# Altium schematic sheet Aux_Outputs.SchDoc: RP2040 CNC
size B; Author: AM; CompanyName: Expatria Technologies; DrawnBy: A.Marles; Engineer: AM; Organization: Expatria Technolgoies; Address1: PO Box 2084; Address3: Merritt, BC V1K 1B8; Address4: Canada; DocumentNumber: 13; SheetNumber: 10; SheetTotal: 26
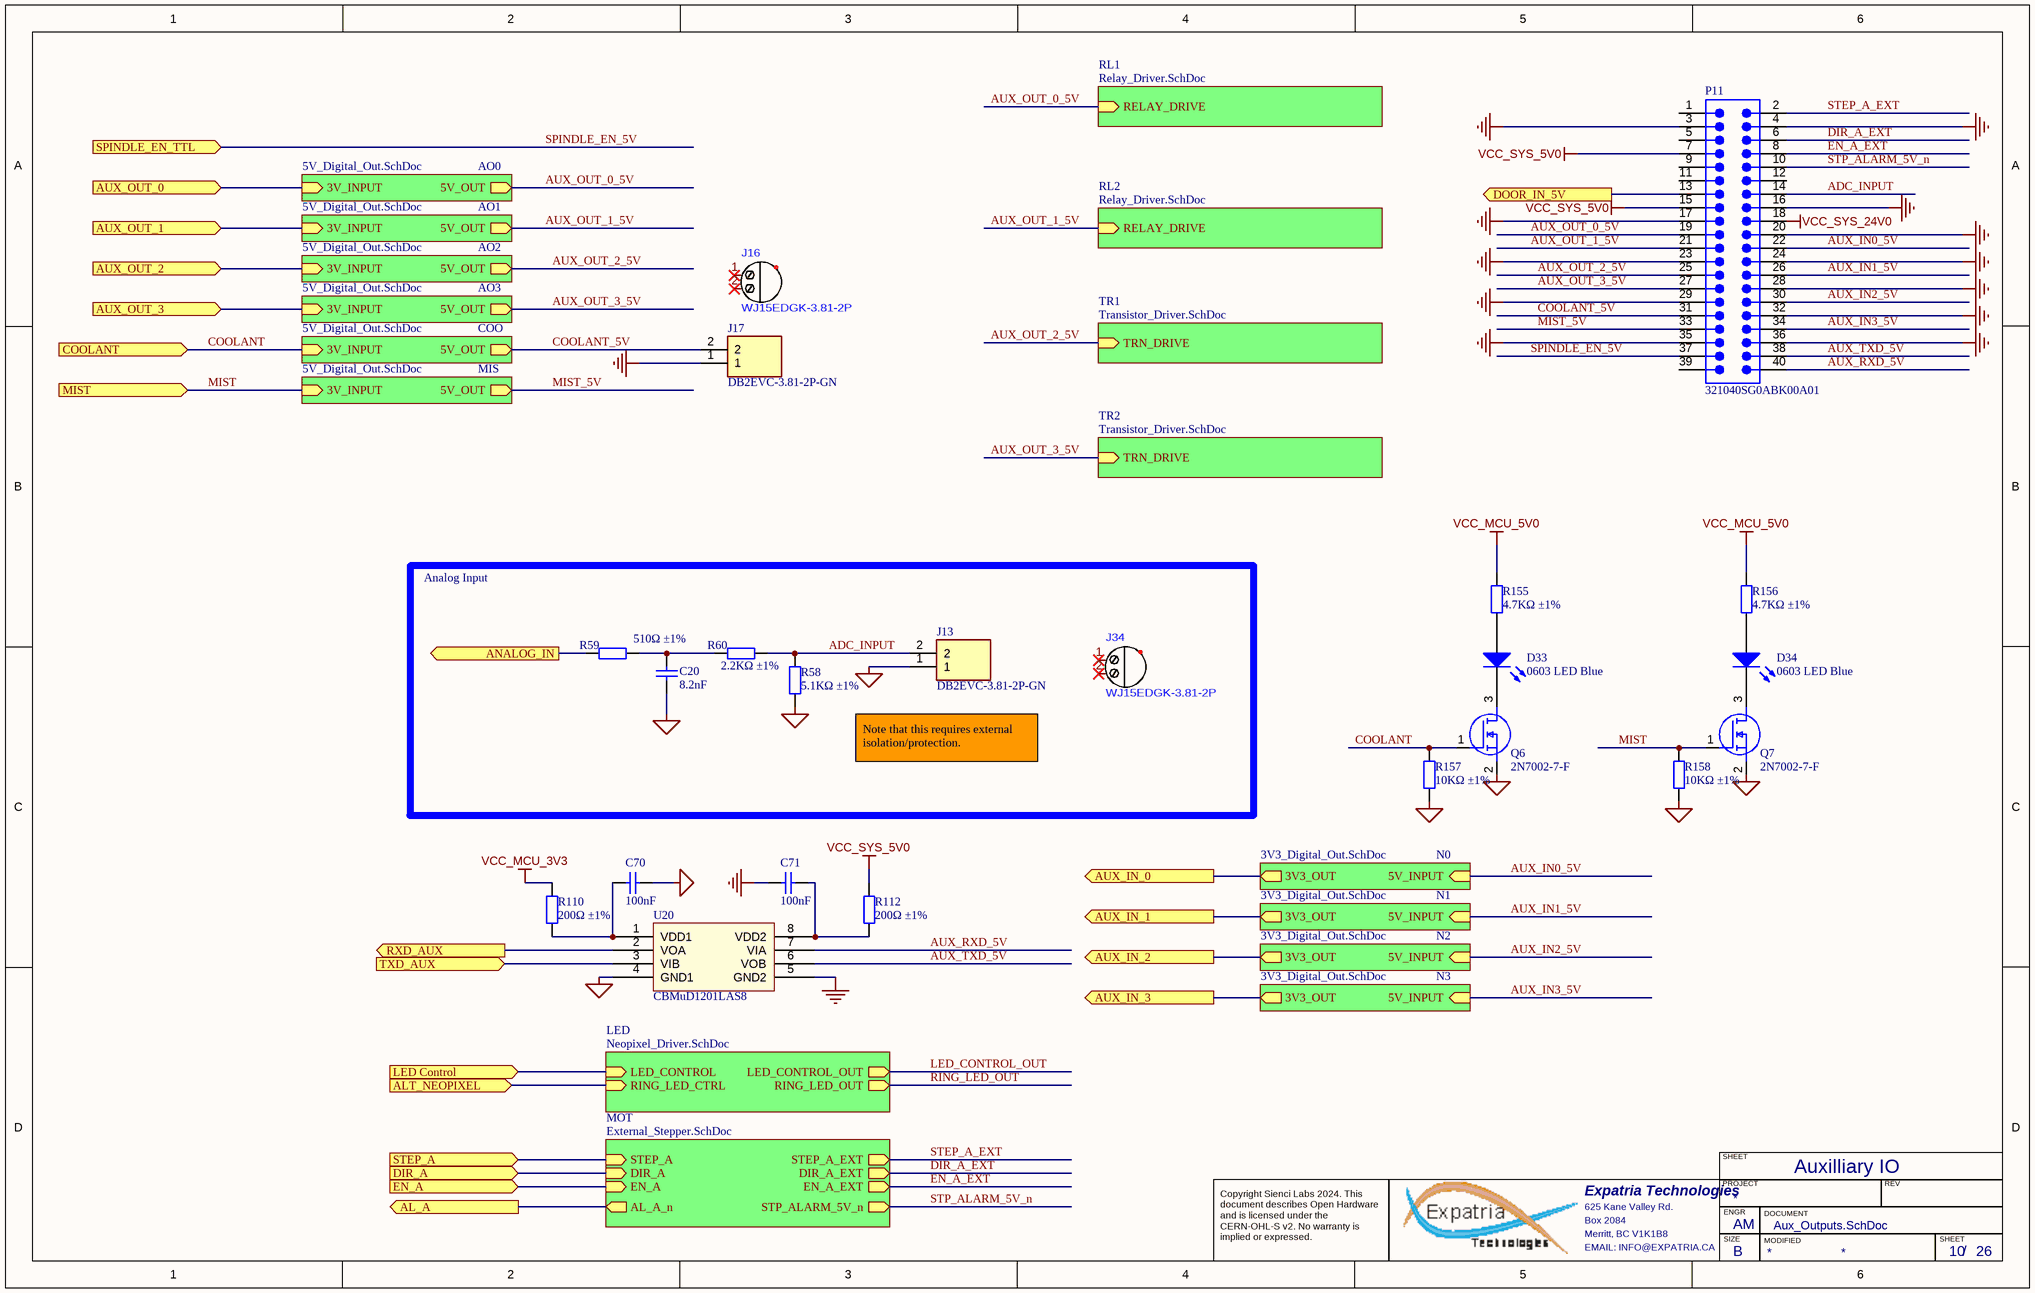
[diagram p0: Aux_Outputs.SchDoc]

## Parts
C20  8.2nF  [0603_C]
C70  100nF  [0402_C]
C71  100nF  [0402_C]
D33  0603 LED Blue  [0603_LED_S1 - BLUE]
D34  0603 LED Blue  [0603_LED_S1 - BLUE]
J13  DB2EVC-3.81-2P-GN  [CONN-TH_5P-P3.81_DB2EVC-3.81-2p]
J16  WJ15EDGK-3.81-2P  (mechanical)
J17  DB2EVC-3.81-2P-GN  [CONN-TH_5P-P3.81_DB2EVC-3.81-2p]
J34  WJ15EDGK-3.81-2P  (mechanical)
P11  321040SG0ABK00A01  [IDC-TH_40P-P2.54_321040SG0ABK00A01]
Q6  2N7002-7-F  [SOT-23(SOT-23-3)]
Q7  2N7002-7-F  [SOT-23(SOT-23-3)]
R58  5.1KΩ ±1%  [0402_R]
R59  510Ω ±1%  [0402_R]
R60  2.2KΩ ±1%  [0402_R]
R110  200Ω ±1%  [0402_R]
R112  200Ω ±1%  [0402_R]
R155  4.7KΩ ±1%  [0402_R]
R156  4.7KΩ ±1%  [0402_R]
R157  10KΩ ±1%  [0603_R]
R158  10KΩ ±1%  [0603_R]
U20  CBMuD1201LAS8  [SOIC-8_150mil]

## Blocks framed on the sheet
Analog Input: C20 J13 J34 R58-R60

## Sub-sheets
AO0 = 5V_Digital_Out.SchDoc: 5V_OUT (out), 3V_INPUT (in)
AO1 = 5V_Digital_Out.SchDoc: 5V_OUT (out), 3V_INPUT (in)
AO2 = 5V_Digital_Out.SchDoc: 5V_OUT (out), 3V_INPUT (in)
AO3 = 5V_Digital_Out.SchDoc: 5V_OUT (out), 3V_INPUT (in)
COO = 5V_Digital_Out.SchDoc: 5V_OUT (out), 3V_INPUT (in)
LED = Neopixel_Driver.SchDoc: LED_CONTROL (in), LED_CONTROL_OUT (out), RING_LED_OUT (out), RING_LED_CTRL (in)
MIS = 5V_Digital_Out.SchDoc: 5V_OUT (out), 3V_INPUT (in)
MOT = External_Stepper.SchDoc: STEP_A (in), EN_A (in), AL_A_n (out), DIR_A (in), EN_A_EXT (out), DIR_A_EXT (out), STP_ALARM_5V_n (out), STEP_A_EXT (out)
N0 = 3V3_Digital_Out.SchDoc: 3V3_OUT (out), 5V_INPUT (in)
N1 = 3V3_Digital_Out.SchDoc: 3V3_OUT (out), 5V_INPUT (in)
N2 = 3V3_Digital_Out.SchDoc: 3V3_OUT (out), 5V_INPUT (in)
N3 = 3V3_Digital_Out.SchDoc: 3V3_OUT (out), 5V_INPUT (in)
RL1 = Relay_Driver.SchDoc: RELAY_DRIVE (in)
RL2 = Relay_Driver.SchDoc: RELAY_DRIVE (in)
TR1 = Transistor_Driver.SchDoc: TRN_DRIVE (in)
TR2 = Transistor_Driver.SchDoc: TRN_DRIVE (in)

## Ports
AL_A (out), ALT_NEOPIXEL (in), ANALOG_IN (out), AUX_IN_0 (out), AUX_IN_1 (out), AUX_IN_2 (out), AUX_IN_3 (out), AUX_OUT_0 (in), AUX_OUT_1 (in), AUX_OUT_2 (in), AUX_OUT_3 (in), COOLANT (in), DIR_A (in), DOOR_IN_5V (out), EN_A (in), LED Control (in), MIST (in), RXD_AUX (out), SPINDLE_EN_TTL (in), STEP_A (in), TXD_AUX (in)

## Nets
GND: C71.1 J17.1 P11.3 P11.4 P11.16 P11.17 P11.20 P11.23 P11.24 P11.28 P11.29 P11.32 P11.35 P11.36 U20.5(GND2)
MCU_GND: C20.1 C70.2 J13.1 Q6.2(S) Q7.2(S) R58.1 R157.1 R158.1 U20.4(GND1)
VCC_MCU_3V3: R110.1
VCC_MCU_5V0: R155.2 R156.2
VCC_SYS_5V0: P11.7 P11.15 R112.1
VCC_SYS_24V0: P11.18
ADC_INPUT: J13.2 P11.14 R58.2 R60.2
AL_A: port AL_A, sheet MOT/AL_A_n
ALT_NEOPIXEL: port ALT_NEOPIXEL, sheet LED/RING_LED_CTRL
ANALOG_IN: R59.1 ; port ANALOG_IN
AUX_IN0_5V: P11.22 ; sheet N0/5V_INPUT
AUX_IN1_5V: P11.26 ; sheet N1/5V_INPUT
AUX_IN2_5V: P11.30 ; sheet N2/5V_INPUT
AUX_IN3_5V: P11.34 ; sheet N3/5V_INPUT
AUX_IN_0: port AUX_IN_0, sheet N0/3V3_OUT
AUX_IN_1: port AUX_IN_1, sheet N1/3V3_OUT
AUX_IN_2: port AUX_IN_2, sheet N2/3V3_OUT
AUX_IN_3: port AUX_IN_3, sheet N3/3V3_OUT
AUX_OUT_0: port AUX_OUT_0, sheet AO0/3V_INPUT
AUX_OUT_0_5V: P11.19 ; sheet RL1/RELAY_DRIVE, sheet AO0/5V_OUT
AUX_OUT_1: port AUX_OUT_1, sheet AO1/3V_INPUT
AUX_OUT_1_5V: P11.21 ; sheet RL2/RELAY_DRIVE, sheet AO1/5V_OUT
AUX_OUT_2: port AUX_OUT_2, sheet AO2/3V_INPUT
AUX_OUT_2_5V: P11.25 ; sheet TR1/TRN_DRIVE, sheet AO2/5V_OUT
AUX_OUT_3: port AUX_OUT_3, sheet AO3/3V_INPUT
AUX_OUT_3_5V: P11.27 ; sheet AO3/5V_OUT, sheet TR2/TRN_DRIVE
AUX_RXD_5V: P11.40 U20.7(VIA)
AUX_TXD_5V: P11.38 U20.6(VOB)
COOLANT: Q6.1(G) R157.2 ; port COOLANT, sheet COO/3V_INPUT
COOLANT_5V: J17.2 P11.31 ; sheet COO/5V_OUT
DIR_A: port DIR_A, sheet MOT/DIR_A
DIR_A_EXT: P11.6 ; sheet MOT/DIR_A_EXT
DOOR_IN_5V: P11.13 ; port DOOR_IN_5V
EN_A: port EN_A, sheet MOT/EN_A
EN_A_EXT: P11.8 ; sheet MOT/EN_A_EXT
LED Control: port LED Control, sheet LED/LED_CONTROL
LED_CONTROL_OUT: sheet LED/LED_CONTROL_OUT
MIST: Q7.1(G) R158.2 ; port MIST, sheet MIS/3V_INPUT
MIST_5V: P11.33 ; sheet MIS/5V_OUT
RING_LED_OUT: sheet LED/RING_LED_OUT
RXD_AUX: U20.2(VOA) ; port RXD_AUX
SPINDLE_EN_5V: P11.37 ; port SPINDLE_EN_TTL
STEP_A: port STEP_A, sheet MOT/STEP_A
STEP_A_EXT: P11.2 ; sheet MOT/STEP_A_EXT
STP_ALARM_5V_n: P11.10 ; sheet MOT/STP_ALARM_5V_n
TXD_AUX: U20.3(VIB) ; port TXD_AUX
NetC20_2: C20.2 R59.2 R60.1
NetC70_1: C70.1 R110.2 U20.1(VDD1)
NetC71_2: C71.2 R112.2 U20.8(VDD2)
NetD33_A: D33.A R155.1
NetD33_K: D33.K Q6.3(D)
NetD34_A: D34.A R156.1
NetD34_K: D34.K Q7.3(D)

Not connected (* = marked no-connect by the designer): J16 1* 2*; J34 1* 2*; P11 1 5 9 11 12 39

## Notes on the sheet
- Note that this requires external isolation/protection.
- Auxilliary IO
- SHEET
- Expatria Technologies
- 625 Kane Valley Rd.
- Box 2084
- Merritt, BC V1K1B8
- PROJECT
- SIZE
- ENGR
- MODIFIED
- DOCUMENT
- REV
- Copyright Sienci Labs 2024. This document describes Open Hardware and is licensed under the CERN-OHL-S v2. No warranty is implied or expressed.
- EMAIL: INFO@EXPATRIA.CA
- B
- /

## Library data of the parts
C20 = 0603 8.2nF (822) 10% 50V: 50V 8.2nF X7R ±10% 0603 Multilayer Ceramic Capacitors MLCC - SMD/SMT ROHS; Manufacturer: YAGEO; Manufacturer Part Number: CC0603KRX7R9BB822; Package: 0603; Supplier: LC; SuppliersPartNumber: C113812; Capacitance: 8.2nF; Tolerance: 10%; Voltage: 50V; Manufacturer 1: YAGEO; Manufacturer Part Number 1: CC0603KRX7R9BB822; Value: 8.2nF
C70 C71 = 0402 100nF (104) 10% 16V: 16V 100nF X7R ±10% 0402 Multilayer Ceramic Capacitors MLCC - SMD/SMT ROHS; Manufacturer: Samsung Electro-Mechanics; Manufacturer Part Number: CL05B104KO5NNNC; ComponentLink1Description: Supplier link; ComponentLink1URL: http://www.szlcsc.com/product/details_1877.html; Package: 0402; Supplier: LC; SuppliersPartNumber: C1525; Capacitance: 100nF; Tolerance: 10%; Voltage: 16V
D33 D34 = 0603 LED Blue: Colorless transparence -40℃~+85℃ 465nm~475nm blue 120° 110mW 0603 Light Emitting Diodes (LED) ROHS; Manufacturer: Everlight Elec; Manufacturer Part Number: 19-217/BHC-ZL1M2RY/3T; Package: 0603; Supplier: LC; SuppliersPartNumber: C72041; Color: Blue
J13 J17 = DB2EVC-3.81-2P-GN: 3.81mm Green Board Edge/Receptacle-Close Push-Pull,P=3.81mm Pluggable System Terminal Block ROHS; Manufacturer: DIBO; Manufacturer Part Number: DB2EVC-3.81-2P-GN; SuppliersPartNumber: C395686; Supplier: LCSC; Value: DB2EVC-3.81-2P-GN
J16 J34 = WJ15EDGK-3.81-2P: 2 1 3.81mm Green Plug P=3.81mm Pluggable System Terminal Block ROHS; Manufacturer: Ningbo; Supplier: LCSC; Supplier Part Number 1: C8466; Manufacturer Part Number: WJ15EDGK-3.81-2P; RoHS: Yes; SuppliersPartNumber: C8466
P11 = 321040SG0ABK00A01: 2.54mm Straight Gold Brass 20 Push - Pull 2.54mm 2 Straight,P=2.54mm IDC Connectors ROHS; Manufacturer: JILN; SuppliersPartNumber: C601944; Supplier: LCSC; Manufacturer Part Number: 321040SG0ABK00A01
Q6 Q7 = 2N7002-7-F: 60V 115mA 7.5Ω@5V,50mA 370mW N Channel SOT-23 MOSFETs ROHS; Manufacturer: Diodes Inc.; SuppliersPartNumber: C85049; Manufacturer Part Number: 2N7002-7-F; Value: 2N7002-7-F; Datasheet Link: https://datasheet.datasheetarchive.com/originals/distributors/SFDatasheet-0/sf-0003625.pdf; Height: 1.2mm; Manufacturer_Part_Number: 2N7002-7-F; Mouser Part Number: 621-2N7002-F; Mouser Price/Stock: https://www.mouser.co.uk/ProductDetail/Diodes-Incorporated/2N7002-7-F?qs=jMXWnm70%252BC%252BAX%252BMLzUkTZg%3D%3D; Arrow Part Number: 2N7002-7-F; Arrow Price/Stock: https://www.arrow.com/en/products/2n7002-7-f/diodes-incorporated?region=nac
R58 = 0402 5.1K (5101) 1%: Chip resistor; Manufacturer: Uniroyal Elec; Manufacturer Part Number: 0402WGF5101TCE; Power: 1/16W; Resistance: 51.1KΩ; ComponentLink1Description: Supplier link; ComponentLink1URL: http://www.szlcsc.com/product/details_26648.html; Package: 0402; Supplier: LCSC; SuppliersPartNumber: C25905; Tolerance: 1%
R59 = 0402 510R (5100) 1%: Chip resistor; Manufacturer: Uniroyal Elec; Manufacturer Part Number: 0402WGF5100TCE; Power: 1/16W; Package: 0402; Supplier: LC; SuppliersPartNumber: C25123; Resistance: 510Ω; Tolerance: 1%
R60 = 0402 2.2K (2201) 1%: Chip resistor; Manufacturer: Uniroyal Elec; Manufacturer Part Number: 0402WGF2201TCE; Power: 1/16W; ComponentLink1Description: Supplier link; ComponentLink1URL: http://www.szlcsc.com/product/details_26622.html; Package: 0402; Supplier: LCSC; SuppliersPartNumber: C25879; Resistance: 2.2KΩ; Tolerance: 1%
R110 R112 = 0402 200R (2000) 1%: Chip resistor; Manufacturer: Uniroyal Elec; Manufacturer Part Number: 0402WGF2000TCE; Power: 1/16W; Package: 0402; Supplier: LC; SuppliersPartNumber: C25087; Resistance: 200Ω; Tolerance: 1%; ComponentLink1Description: Supplier link; ComponentLink1URL: http://www.szlcsc.com/product/details_25830.html
R155 R156 = 0402 4.7K (4701) 1%: Chip resistor; Manufacturer: Uniroyal Elec; Manufacturer Part Number: 0402WGF4701TCE; Power: 1/16W; ComponentLink1Description: Supplier link; ComponentLink1URL: http://www.szlcsc.com/product/details_26643.html; Package: 0402; Supplier: LCSC; SuppliersPartNumber: C25900; Resistance: 4.7KΩ; Tolerance: 1%
R157 R158 = 0603 10K (1002) 1%: Chip resistor; Manufacturer: Uniroyal Elec; Manufacturer Part Number: 0603WAF1002T5E; Power: 1/10W; Package: 0603; Supplier: LCSC; SuppliersPartNumber: C25804; Resistance: 10KΩ; Tolerance: 1%; ComponentLink1Description: Supplier link; ComponentLink1URL: http://www.szlcsc.com/product/details_26547.html
U20 = CBMuD1201LAS8: Dual Channel Isolator; Manufacturer: Corebai Microelectronics; Package: SOIC-8_150mil; Supplier: LC; SuppliersPartNumber: C476472; ComponentLink1Description: 供应商链接; ComponentLink1URL: http://www.szlcsc.com/product/details_10199.html; Manufacturer Part Number: CBMuD1201LAS8